# Altium schematic sheet Top Level.SchDoc
size A4
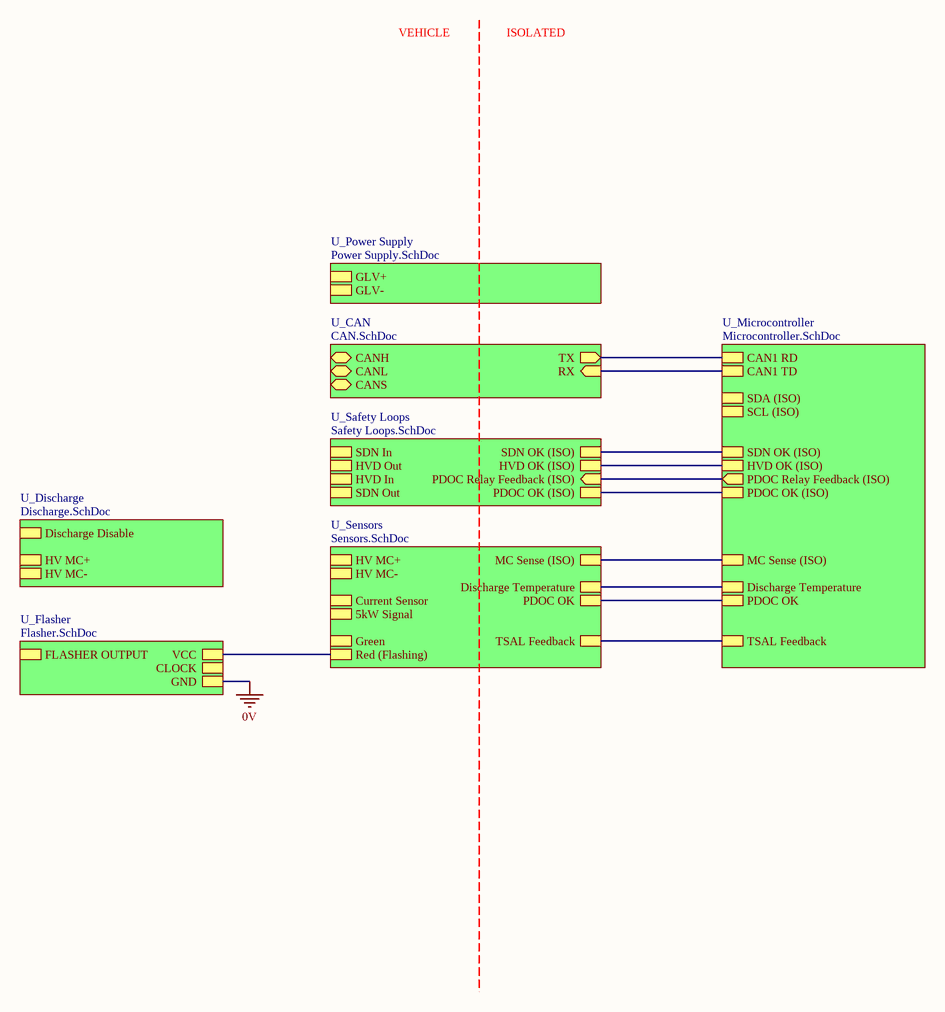
[diagram p0: Top Level.SchDoc]

## Sub-sheets
U_CAN = CAN.SchDoc: CANS (bidir), RX (in), CANL (bidir), CANH (bidir), TX (out)
U_Discharge = Discharge.SchDoc: HV MC+, HV MC-, Discharge Disable
U_Flasher = Flasher.SchDoc: VCC, GND, CLOCK, FLASHER OUTPUT
U_Microcontroller = Microcontroller.SchDoc: CAN1 RD, CAN1 TD, SDN OK (ISO), HVD OK (ISO), PDOC Relay Feedback (ISO) (out), PDOC OK (ISO), MC Sense (ISO), Discharge Temperature, PDOC OK, TSAL Feedback, SDA (ISO), SCL (ISO)
U_Power Supply = Power Supply.SchDoc: GLV+, GLV-
U_Safety Loops = Safety Loops.SchDoc: HVD Out, SDN In, SDN OK (ISO), SDN Out, HVD In, HVD OK (ISO), PDOC Relay Feedback (ISO) (in), PDOC OK (ISO)
U_Sensors = Sensors.SchDoc: HV MC+, HV MC-, MC Sense (ISO), TSAL Feedback, Current Sensor, 5kW Signal, Green, Red (Flashing), PDOC OK, Discharge Temperature

## Nets
0V: sheet U_Flasher/GND
(unnamed): sheet U_CAN/RX, sheet U_Microcontroller/CAN1 TD
(unnamed): sheet U_CAN/TX, sheet U_Microcontroller/CAN1 RD
(unnamed): sheet U_Safety Loops/SDN OK (ISO), sheet U_Microcontroller/SDN OK (ISO)
(unnamed): sheet U_Safety Loops/HVD OK (ISO), sheet U_Microcontroller/HVD OK (ISO)
(unnamed): sheet U_Safety Loops/PDOC Relay Feedback (ISO), sheet U_Microcontroller/PDOC Relay Feedback (ISO)
(unnamed): sheet U_Safety Loops/PDOC OK (ISO), sheet U_Microcontroller/PDOC OK (ISO)
(unnamed): sheet U_Sensors/MC Sense (ISO), sheet U_Microcontroller/MC Sense (ISO)
(unnamed): sheet U_Sensors/TSAL Feedback, sheet U_Microcontroller/TSAL Feedback
(unnamed): sheet U_Sensors/Red (Flashing), sheet U_Flasher/VCC
(unnamed): sheet U_Sensors/PDOC OK, sheet U_Microcontroller/PDOC OK
(unnamed): sheet U_Sensors/Discharge Temperature, sheet U_Microcontroller/Discharge Temperature

## Notes on the sheet
- VEHICLE
- ISOLATED